# Altium schematic sheet Power.SchDoc
size Tabloid; Author: AG; SheetNumber: 3; SheetTotal: 9; PageSetup: Record=PageOptions|CenterHorizontal=True|CenterVertical=True|PrintScale=1.00|XCorrection=1.00|YCorrection=1.00|PrintKind=1|BorderSize=5000000|LeftOffset=0|BottomOffset=0|Orientation=2|PaperLength=1000|PaperWidth=1000|Scale=100|PaperSource=7|PrintQuality=-4|MediaType=1|DitherType=10|PaperKind=Ledger|PrintScaleMode=1; cpr-ItemNumber: 025619; cpr-ItemName1: TURTLEBOT4 UI Board; cpr-ItemName2: Rev 2; cpr-Revision: 2; cpr-SheetNumber: 3; cpr-SheetTotal: 9; cpr-Draft: AG; cpr-DraftDate: 19/04/2022; cpr-Rigour1: X; cpr-Rigour2: X; cpr-Rigour1Date: X; cpr-Rigour2Date: X
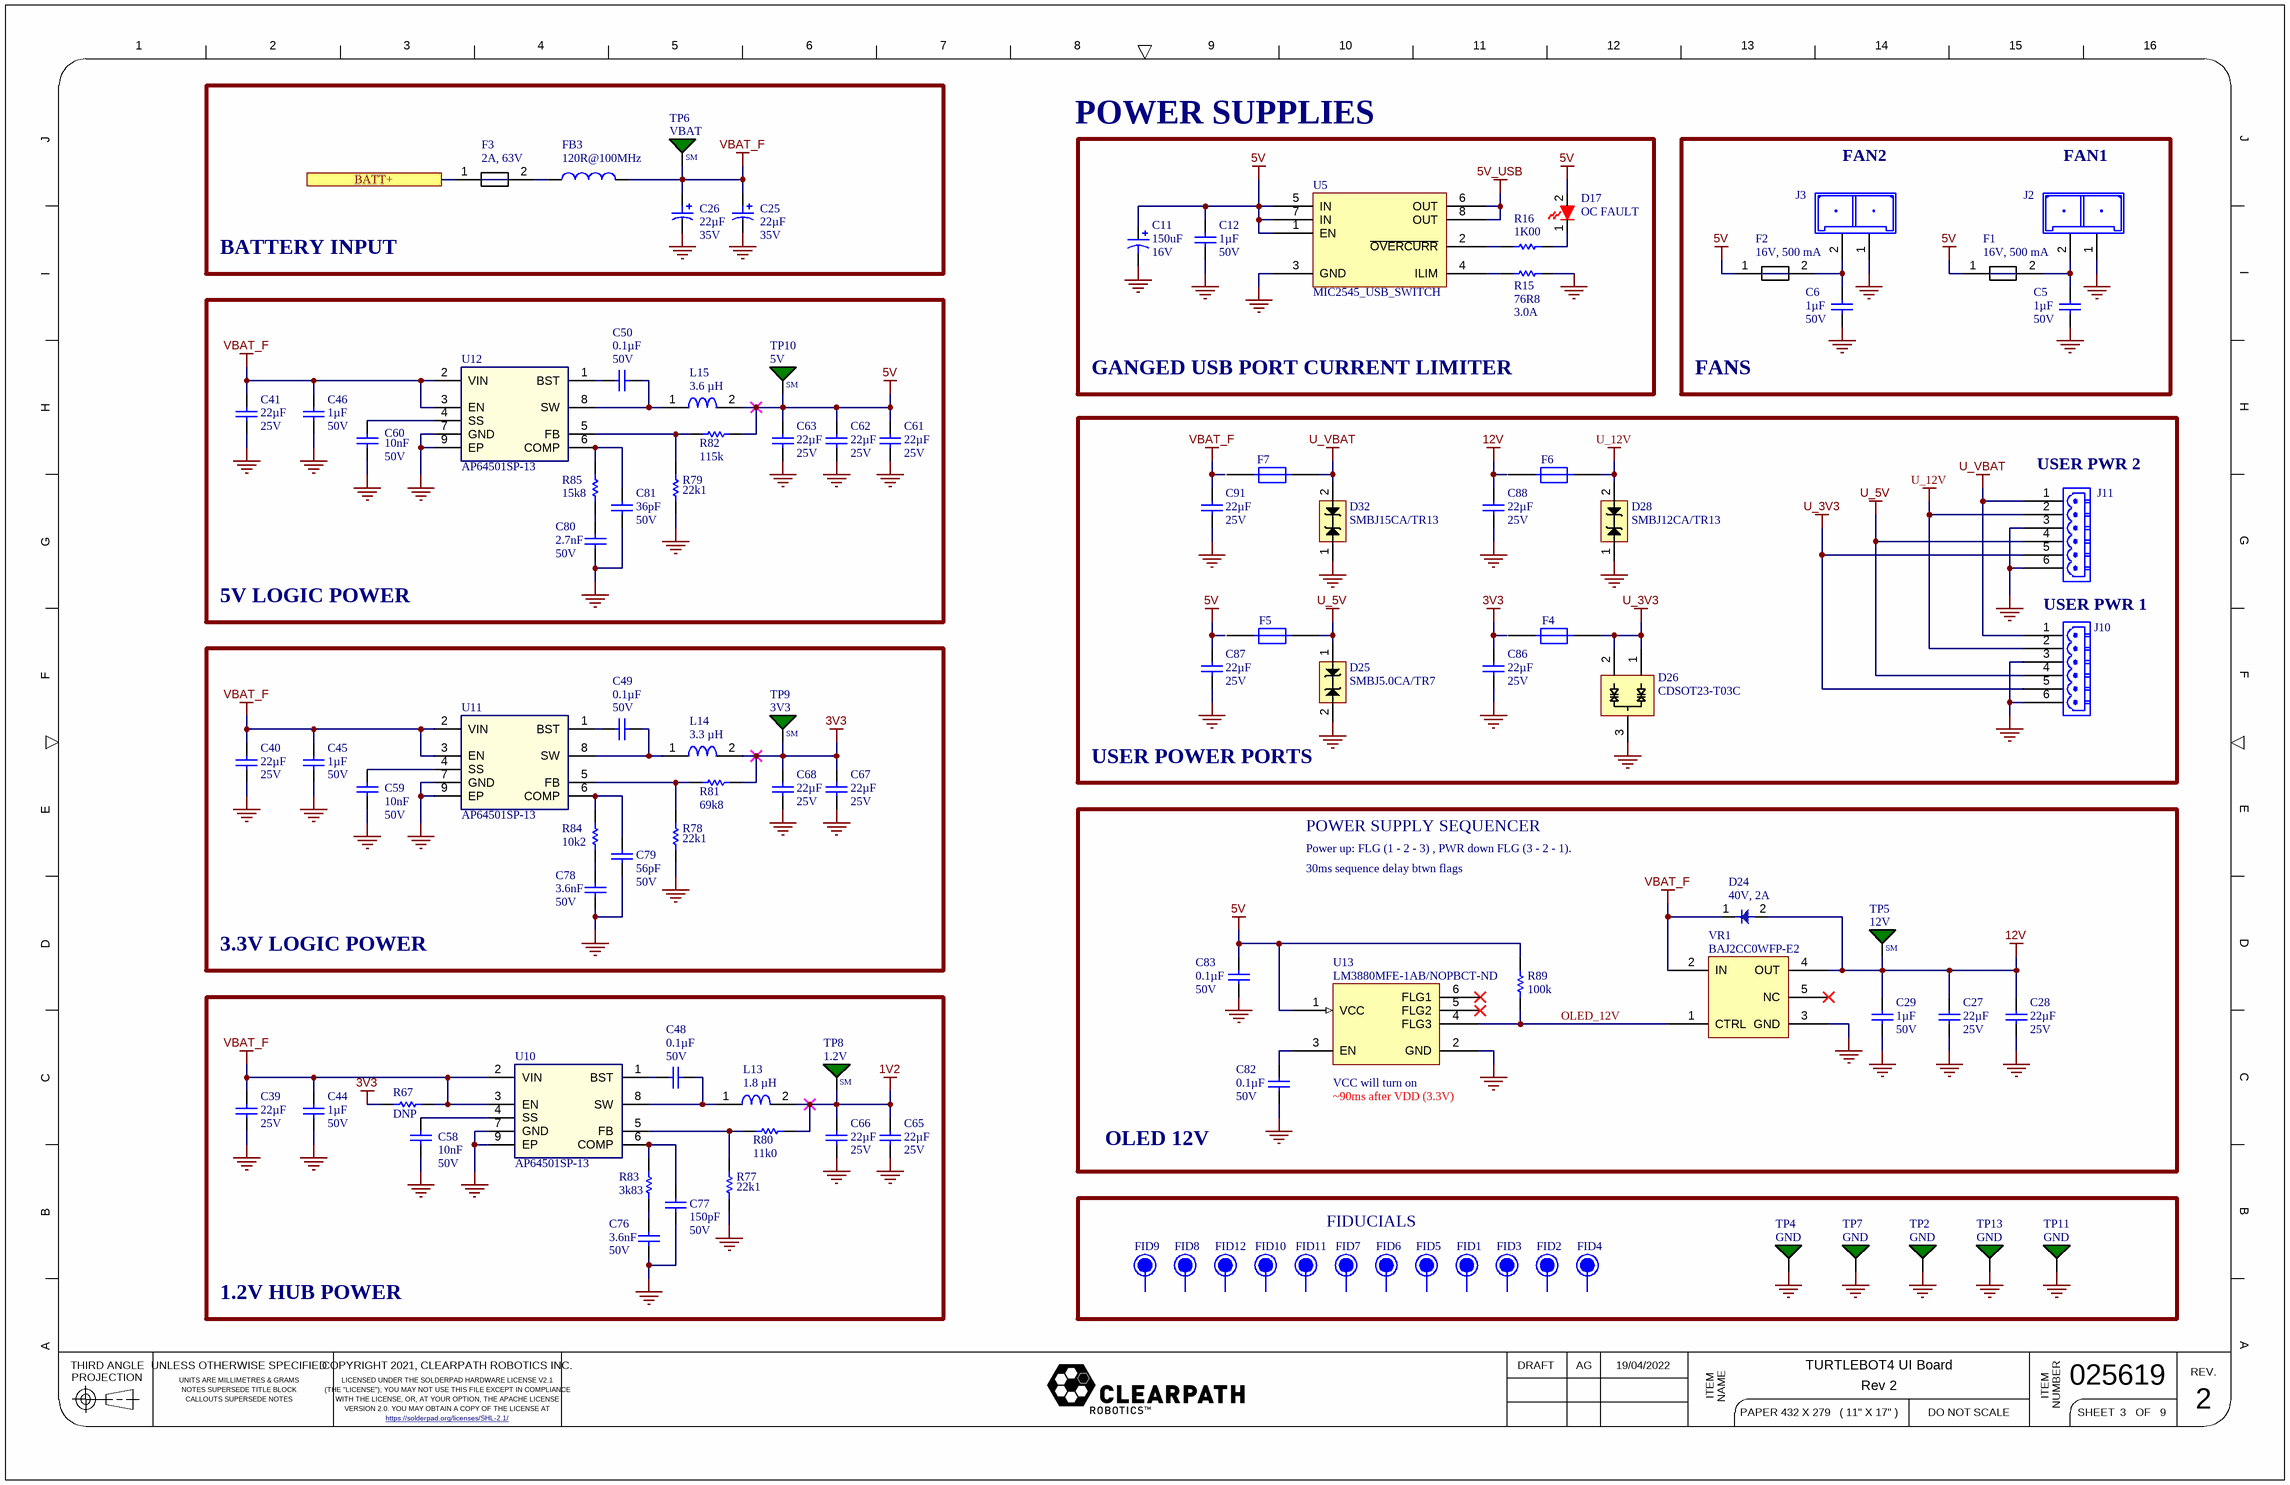
[diagram p0: Power.SchDoc]

## Parts
C5  Capacitance: 1µF  Voltage: 50V  [CAP 0805]  (hidden comment: Cap)
C6  Capacitance: 1µF  Voltage: 50V  [CAP 0805]  (hidden comment: Cap)
C11  value 150uF  Voltage: 16V  [CAPMP7.6X4.3_3.1N_KEM-M]  (hidden comment: Cap Tant)
C12  Capacitance: 1µF  Voltage: 50V  [CAP 0805]  (hidden comment: Cap)
C25  Capacitance: 22µF  Voltage: 35V  [PCAP F61]  (hidden comment: Pcap)
C26  Capacitance: 22µF  Voltage: 35V  [PCAP F61]  (hidden comment: Pcap)
C27  Capacitance: 22µF  Voltage: 25V  [CAP 1210]  (hidden comment: Cap)
C28  Capacitance: 22µF  Voltage: 25V  [CAP 1210]  (hidden comment: Cap)
C29  Capacitance: 1µF  Voltage: 50V  [CAP 0805]  (hidden comment: Cap)
C39  Capacitance: 22µF  Voltage: 25V  [CAP 1210]  (hidden comment: Cap)
C40  Capacitance: 22µF  Voltage: 25V  [CAP 1210]  (hidden comment: Cap)
C41  Capacitance: 22µF  Voltage: 25V  [CAP 1210]  (hidden comment: Cap)
C44  Capacitance: 1µF  Voltage: 50V  [CAP 0805]  (hidden comment: Cap)
C45  Capacitance: 1µF  Voltage: 50V  [CAP 0805]  (hidden comment: Cap)
C46  Capacitance: 1µF  Voltage: 50V  [CAP 0805]  (hidden comment: Cap)
C48  Capacitance: 0.1µF  Voltage: 50V  [CAP 0805]  (hidden comment: Cap)
C49  Capacitance: 0.1µF  Voltage: 50V  [CAP 0805]  (hidden comment: Cap)
C50  Capacitance: 0.1µF  Voltage: 50V  [CAP 0805]  (hidden comment: Cap)
C58  Capacitance: 10nF  Voltage: 50V  [CAP 0603]  (hidden comment: Cap)
C59  Capacitance: 10nF  Voltage: 50V  [CAP 0603]  (hidden comment: Cap)
C60  Capacitance: 10nF  Voltage: 50V  [CAP 0603]  (hidden comment: Cap)
C61  Capacitance: 22µF  Voltage: 25V  [CAP 1210]  (hidden comment: Cap)
C62  Capacitance: 22µF  Voltage: 25V  [CAP 1210]  (hidden comment: Cap)
C63  Capacitance: 22µF  Voltage: 25V  [CAP 1210]  (hidden comment: Cap)
C65  Capacitance: 22µF  Voltage: 25V  [CAP 1210]  (hidden comment: Cap)
C66  Capacitance: 22µF  Voltage: 25V  [CAP 1210]  (hidden comment: Cap)
C67  Capacitance: 22µF  Voltage: 25V  [CAP 1210]  (hidden comment: Cap)
C68  Capacitance: 22µF  Voltage: 25V  [CAP 1210]  (hidden comment: Cap)
C76  Capacitance: 3.6nF  Voltage: 50V  [CAP 0603]  (hidden comment: Cap)
C77  Capacitance: 150pF  Voltage: 50V  [CAP 0603]  (hidden comment: Cap)
C78  Capacitance: 3.6nF  Voltage: 50V  [CAP 0603]  (hidden comment: Cap)
C79  Capacitance: 56pF  Voltage: 50V  [CAP 0603]  (hidden comment: Cap)
C80  Capacitance: 2.7nF  Voltage: 50V  [CAP 0603]  (hidden comment: Cap)
C81  Capacitance: 36pF  Voltage: 50V  [CAP 0603]  (hidden comment: Cap)
C82  Capacitance: 0.1µF  Voltage: 50V  [CAP 0805]  (hidden comment: Cap)
C83  Capacitance: 0.1µF  Voltage: 50V  [CAP 0805]  (hidden comment: Cap)
C86  Capacitance: 22µF  Voltage: 25V  [CAP 1210]  (hidden comment: Cap)
C87  Capacitance: 22µF  Voltage: 25V  [CAP 1210]  (hidden comment: Cap)
C88  Capacitance: 22µF  Voltage: 25V  [CAP 1210]  (hidden comment: Cap)
C91  Capacitance: 22µF  Voltage: 25V  [CAP 1210]  (hidden comment: Cap)
D17  OC FAULT  [LED_0805_RED]
D24  40V, 2A  [SMA_DO-214AC]
D25  PCB Component: SMBJ5.0CA/TR7  [DO-214AA]  (hidden comment: TVS DIODE BIDIR 5V SMB)
D26  TVS DIODE 3.3VWM 10.9VC SOT23-3  [SOT-23-3]  (value not drawn)
D28  PCB Component: SMBJ12CA/TR13  [DO-214AA]  (hidden comment: TVS DIODE BIDIR 12V SMB)
D32  PCB Component: SMBJ15CA/TR13  [DO-214AA]  (hidden comment: TVS DIODE BIDIR 15V SMB)
F1  16V, 500 mA  [FUSE 1206]
F2  16V, 500 mA  [FUSE 1206]
F3  2A, 63V  [FUSE 1206]
F4  PTC FUSE PACKAGE 1812  [FUSER_MF-MSMF014]  (value not drawn)
F5  PTC FUSE PACKAGE 1812  [FUSER_MF-MSMF014]  (value not drawn)
F6  PTC FUSE PACKAGE 1812  [FUSER_MF-MSMF014]  (value not drawn)
F7  PTC FUSE PACKAGE 1812  [FUSER_MF-MSMF014]  (value not drawn)
FB3  value 120R@100MHz  [IND_0805]  (hidden comment: Inductor)
FID1  SMT FIDUCIAL  [Fiducial-1mm]  (value not drawn)
FID2  SMT FIDUCIAL  [Fiducial-1mm]  (value not drawn)
FID3  SMT FIDUCIAL  [Fiducial-1mm]  (value not drawn)
FID4  SMT FIDUCIAL  [Fiducial-1mm]  (value not drawn)
FID5  SMT FIDUCIAL  [Fiducial-1mm]  (value not drawn)
FID6  SMT FIDUCIAL  [Fiducial-1mm]  (value not drawn)
FID7  SMT FIDUCIAL  [Fiducial-1mm]  (value not drawn)
FID8  SMT FIDUCIAL  [Fiducial-1mm]  (value not drawn)
FID9  SMT FIDUCIAL  [Fiducial-1mm]  (value not drawn)
FID10  SMT FIDUCIAL  [Fiducial-1mm]  (value not drawn)
FID11  SMT FIDUCIAL  [Fiducial-1mm]  (value not drawn)
FID12  SMT FIDUCIAL  [Fiducial-1mm]  (value not drawn)
J2  FAN  [Molex_0533980276]  (value not drawn)
J3  FAN  [Molex_0533980276]  (value not drawn)
J10  0532610671  [MOLEX_PICOBLADE_532610671]  (value not drawn)
J11  0532610671  [MOLEX_PICOBLADE_532610671]  (value not drawn)
L13  Inductance: 1.8 µH  [IND SRP7050TA]  (hidden comment: Ind)
L14  Inductance: 3.3 µH  [IND SRP7050TA]  (hidden comment: Ind)
L15  Inductance: 3.6 µH  [IND 7447797360]  (hidden comment: Ind)
R15  3.0A  value 76R8  [R0805]
R16  value 1K00  [R0805]  (hidden comment: Resistor_SMT)
R67  Resistance: DNP  [RES 0603]  (hidden comment: Res)
R77  Resistance: 22k1  [RES 0603]  (hidden comment: Res)
R78  Resistance: 22k1  [RES 0603]  (hidden comment: Res)
R79  Resistance: 22k1  [RES 0603]  (hidden comment: Res)
R80  Resistance: 11k0  [RES 0603]  (hidden comment: Res)
R81  Resistance: 69k8  [RES 0603]  (hidden comment: Res)
R82  Resistance: 115k  [RES 0603]  (hidden comment: Res)
R83  Resistance: 3k83  [RES 0603]  (hidden comment: Res)
R84  Resistance: 10k2  [RES 0603]  (hidden comment: Res)
R85  Resistance: 15k8  [RES 0603]  (hidden comment: Res)
R89  Resistance: 100k  [RES 0603]  (hidden comment: Res)
TP2  GND  [S1751-46R]
TP4  GND  [S1751-46R]
TP5  12V  [TP_28SM]
TP6  VBAT  [TP_28SM]
TP7  GND  [S1751-46R]
TP8  1.2V  [TP_28SM]
TP9  3V3  [TP_28SM]
TP10  5V  [TP_28SM]
TP11  GND  [S1751-46R]
TP13  GND  [S1751-46R]
U5  MIC2545_USB_SWITCH  [SOIC-8-150]
U10  AP64501SP-13  [SOIC-8-EP-AP64501]
U11  AP64501SP-13  [SOIC-8-EP-AP64501]
U12  AP64501SP-13  [SOIC-8-EP-AP64501]
U13  Supplier Part Number 1: LM3880MFE-1AB/NOPBCT-ND  [SOT-23-6]  (hidden comment: Power Supply Controller Power Supply Sequencer SOT-23-6)
VR1  BAJ2CC0WFP-E2  [DPAK114P990X239-6N]

## Blocks framed on the sheet
BATTERY INPUT: C25 C26 F3 FB3 TP6
GANGED USB PORT CURRENT LIMITER: C11 C12 D17 R15 R16 U5
FANS: C5 C6 F1 F2 J2 J3
5V LOGIC POWER: C41 C46 C50 C60-C63 C80 C81 L15 R79 R82 R85 TP10 U12
USER POWER PORTS: C86-C88 C91 D25 D26 D28 D32 F4-F7 J10 J11
3.3V LOGIC POWER: C40 C45 C49 C59 C67 C68 C78 C79 L14 R78 R81 R84 TP9 U11
OLED 12V: C27-C29 C82 C83 D24 R89 TP5 U13 VR1
1.2V HUB POWER: C39 C44 C48 C58 C65 C66 C76 C77 L13 R67 R77 R80 R83 TP8 U10
FIDUCIALS: FID1-FID12 TP2 TP4 TP7 TP11 TP13

## Ports
BATT+

## Nets
1V2: C65.2 C66.2 L13.2 R80.2 TP8.1
3V3: C67.2 C68.2 C86.2 L14.2 R67.2 R81.2 TP9.1
5V: C11.1 C12.2 C61.2 C62.2 C63.2 C83.1 C87.2 D17.2(RA) F1.1 F2.1 L15.2 R82.1 R89.2 TP10.1 U5.1(EN) U5.5(IN) U5.7(IN) U13.1(VCC)
5V_USB: U5.6(OUT) U5.8(OUT)
12V: C27.2 C28.2 C29.2 C88.2 D24.2 TP5.1 VR1.4(OUT)
GND: C5.1 C6.1 C11.2 C12.1 C25.2 C26.2 C27.1 C28.1 C29.1 C39.1 C40.1 C41.1 C44.1 C45.1 C46.1 C58.1 C59.1 C60.1 C61.1 C62.1 C63.1 C65.1 C66.1 C67.1 C68.1 C76.1 C77.1 C78.1 C79.1 C80.1 C81.1 C82.2 C83.2 C86.1 C87.1 C88.1 C91.1 D25.2 D26.3 D28.1 D32.1 J2.1 J3.1 J10.3 J10.6 J11.3 J11.6 R15.1 R77.1 R78.1 R79.1 TP2.1 TP4.1 TP7.1 TP11.1 TP13.1 U5.3(GND) U10.7(GND) U10.9(EP) U11.7(GND) U11.9(EP) U12.7(GND) U12.9(EP) U13.2(GND) VR1.3(GND)
U_3V3: D26.1 D26.2 F4.2 J10.5 J11.5
U_5V: D25.1 F5.2 J10.4 J11.4
U_12V: D28.2 F6.2 J10.2 J11.2
U_VBAT: D32.2 F7.2 J10.1 J11.1
VBAT_F: C25.1 C26.1 C39.2 C40.2 C41.2 C44.2 C45.2 C46.2 C91.2 D24.1 FB3.2 R67.1 TP6.1 U10.2(VIN) U10.3(EN) U11.2(VIN) U11.3(EN) U12.2(VIN) U12.3(EN) VR1.2(IN)
BATT+: F3.1 ; port BATT+
OLED_12V: R89.1 U13.4(FLG3) VR1.1(CTRL)
NetC5_2: C5.2 F1.2 J2.2
NetC6_2: C6.2 F2.2 J3.2
NetC48_1: C48.1 U10.1(BST)
NetC48_2: C48.2 L13.1 U10.8(SW)
NetC49_1: C49.1 U11.1(BST)
NetC49_2: C49.2 L14.1 U11.8(SW)
NetC50_1: C50.1 U12.1(BST)
NetC50_2: C50.2 L15.1 U12.8(SW)
NetC58_2: C58.2 U10.4(SS)
NetC59_2: C59.2 U11.4(SS)
NetC60_2: C60.2 U12.4(SS)
NetC76_2: C76.2 R83.1
NetC77_2: C77.2 R83.2 U10.6(COMP)
NetC78_2: C78.2 R84.1
NetC79_2: C79.2 R84.2 U11.6(COMP)
NetC80_2: C80.2 R85.1
NetC81_2: C81.2 R85.2 U12.6(COMP)
NetC82_1: C82.1 U13.3(EN)
NetD17_1: D17.1(RK) R16.1
NetF3_2: F3.2 FB3.1
NetR15_2: R15.2 U5.4(ILIM)
NetR16_2: R16.2 U5.2(~{OVERCURR})
NetR77_2: R77.2 R80.1 U10.5(FB)
NetR78_2: R78.2 R81.1 U11.5(FB)
NetR79_2: R79.2 R82.2 U12.5(FB)

Not connected (* = marked no-connect by the designer): F4 1; F5 1; F6 1; F7 1; FID1 0; FID2 0; FID3 0; FID4 0; FID5 0; FID6 0; FID7 0; FID8 0; FID9 0; FID10 0; FID11 0; FID12 0; U13 5(FLG2)* 6(FLG1)*; VR1 5(NC)*

## Notes on the sheet
- POWER SUPPLIES
- FAN2
- FAN1
- (near J11) USER PWR 2
- USER PWR 1
- POWER SUPPLY SEQUENCER
- Power up: FLG (1 - 2 - 3) , PWR down FLG (3 - 2 - 1).
- 30ms sequence delay btwn flags
- (near U13) VCC will turn on
- ~90ms after VDD (3.3V)
- 1
- 2
- 3
- 4
- 5
- 6
- 7
- 8
- 9
- 10
- 11
- 12
- 13
- 14
- 15
- 16
- J
- I
- H
- G
- F
- E
- D
- C
- B
- A
- THIRD ANGLE
- PROJECTION
- UNLESS OTHERWISE SPECIFIED
- COPYRIGHT 2021, CLEARPATH ROBOTICS INC.
- DRAFT
- REV.
- UNITS ARE MILLIMETRES & GRAMS
- NOTES SUPERSEDE TITLE BLOCK
- CALLOUTS SUPERSEDE NOTES
- LICENSED UNDER THE SOLDERPAD HARDWARE LICENSE V2.1
- (THE "LICENSE"); YOU MAY NOT USE THIS FILE EXCEPT IN COMPLIANCE
- WITH THE LICENSE, OR, AT YOUR OPTION, THE APACHE LICENSE
- VERSION 2.0. YOU MAY OBTAIN A COPY OF THE LICENSE AT
- https://solderpad.org/licenses/SHL-2.1/ <https://solderpad.https://solderpad.org/licenses/SHL-2.1/org/licenses/SHL-2.1/>
- ITEM
- NAME
- PAPER 432 X 279   ( 11" X 17" )
- DO NOT SCALE
- NUMBER
- SHEET
- OF
- (in symbol TP_28SM) SM

## Library data of the parts
C5 C6 C12 C29 C44-C46 = CL21B105KBFNFNE: Capacitor, MLCC, 1 µF, 50V, X7R; Manufacturer: Samsung Electro-Mechanics America, Inc.; ID: 3; Vendor: Digi-Key; Vendor PN: 1276-2928-1-ND; PCB Component: CL21B105KBFNFNE; Status: Draft; Temperature Coefficient: X7R; Octopart Link: https://octopart.com/search?q=CL21B105KBFNFNE&start=0
C11 = Cap Pol1: CAP TANT 150UF 10% 16V 2917; Vendor: Digikey; PCB Component: 293D157X9016D2TE3; Vendor PN: 718-1746-1-ND; Mfg: Vishay Sprague; Tolerance: 10%; Package: 2917; Supplier 1: Digi-Key; Supplier Part Number 1: 718-1746-1-ND
C25 C26 = 35SVPF22M: Capacitor, Aluminum electrolytic, 22 µF, 35V; Manufacturer: Panasonic Electronic Components; ID: 51; Vendor: Digi-Key; Vendor PN: P16560CT-ND; Temperature Coefficient: -55 - 105C; PCB Component: 35SVPF22M; Status: Draft; Octopart Link: https://octopart.com/35svpf22m-panasonic-29498451?r=sp
C27 C28 C39-C41 C61-C63 C65-C68 C86-C88 C91 = CL32A226KAJNNNE: Capacitor, MLCC, 22 µF, 25V, X5R; Manufacturer: Samsung Electro-Mechanics America, Inc.; Part Number (Alternate): 12103D226MAT2A; Manufacturer (Alternate): Kyocera AVX; ID: 61; Vendor: Digi-Key; Vendor PN: 1276-1101-1-ND; PCB Component: CL32A226KAJNNNE; Status: Draft; Temperature Coefficient: X5R; RoHS: RoHS3
C48-C50 C82 C83 = 08055C104JAT4A: Capacitor, MLCC, 0.1 µF, 50V, X7R; Manufacturer: Kyocera AVX; ID: 4; Vendor: Digi-Key; Vendor PN: 478-7609-1-ND; PCB Component: 08055C104JAT4A; Status: Draft; Temperature Coefficient: X7R; Octopart Link: https://octopart.com/search?q=GRM21BR71H104JA01L&start=0
C58-C60 = 06035C103JAT2A: Capacitor, MLCC, 10 nF, 50V, X7R; Manufacturer: Kyocera AVX; ID: 6; Vendor: Digi-Key; Vendor PN: 478-5007-1-ND; PCB Component: 06035C103JAT2A; Status: Draft; Temperature Coefficient: X7R; Octopart Link: https://octopart.com/06035c103jat2a-avx-34473?r=sp&s=1d6k5wbTSZm7nYOG1M22IA
C76 C78 = GRM1885C1H362JA01D: Capacitor, MLCC, 3.6 nF, 50V, NP0/C0G; Manufacturer: Murata Electronics North America; ID: 56; Vendor: Digi-Key; Vendor PN: 490-6386-1-ND; PCB Component: GRM1885C1H362JA01D; Status: Draft; Temperature Coefficient: NP0/C0G
C77 = CC0603JRNPO9BN151: Capacitor, MLCC, 150 pF, 50V, NP0/C0G; Manufacturer: Yageo; ID: 59; Vendor: Digi-Key; Vendor PN: 311-1071-1-ND; PCB Component: CC0603JRNPO9BN151; Status: Draft; Temperature Coefficient: NP0/C0G
C79 = CC0603FRNPO9BN560: Capacitor, MLCC, 56 pF, 50V, NP0/C0G; Manufacturer: Yageo; ID: 58; Vendor: Digi-Key; Vendor PN: 311-3902-1-ND; PCB Component: CC0603FRNPO9BN560; Status: Draft; Temperature Coefficient: NP0/C0G
C80 = GRM1885C1H272JA01D: Capacitor, MLCC, 2.7 nF, 50V, NP0/C0G; Manufacturer: Murata Electronics North America; ID: 55; Vendor: Digi-Key; Vendor PN: 490-3283-1-ND; PCB Component: GRM1885C1H272JA01D; Status: Draft; Temperature Coefficient: NP0/C0G
C81 = CC0603JRNPO9BN360: Capacitor, MLCC, 36 pF, 50V, NP0/C0G; Manufacturer: Yageo; ID: 57; Vendor: Digi-Key; Vendor PN: 311-3629-1-ND; PCB Component: CC0603JRNPO9BN360; Status: Draft; Temperature Coefficient: NP0/C0G
D17 = RED_LED: Red LED; Vendor: Digikey; Mfg PN: LTST-C170EKT; Mfg: LiteOn; Vendor 1: 160-1178-1-ND; Package: 0805
D24 = CDBA240LL-HF: Diode, Schottky, 40V, 2A; Manufacturer: Comchip Technology; ID: 17; Vendor: Digi-Key; Vendor PN: 641-1698-1-ND; PCB Component: CDBA240LL-HF; Status: Draft; Type: Schottky; Current: 2A; Voltage: 40V; Octopart Link: https://octopart.com/cdba240ll-hf-comchip-22883451?r=sp&s=WlHitoGjQImeZn6B8IAMTQ
D25 = TVS DIODE BIDIR 15V SMC: TVS DIODE 5VWM 9.2VC DO214AA; pin to pad: 1>2 2>1; Vendor: Digikey; Vendor PN: YAG6582CT-ND; Mfg: YAGEO; Package: DO-214AA; Supplier 1: Digi-Key; Supplier Part Number 1: YAG6582TR-ND
D26 = CDSOT23-T03C: Supplier 1: Digi-Key; Supplier Part Number 1: CDSOT23-T03CCT-ND; PCB Component: CDSOT23-T03C
D28 = TVS DIODE BIDIR 15V SMC: TVS 600W 12.8V BI-DIR DO-214AA; Vendor: Digikey; Vendor PN: 13-SMBJ12CA/TR13CT-ND; Mfg: Littelfuse Inc.; Package: DO214AA; Supplier 1: Digi-Key; Supplier Part Number 1: F10828CT-ND
D32 = TVS DIODE BIDIR 15V SMC: TVS DIODE 15VWM 24.4VC DO214AA; Vendor: Digikey; Vendor PN: 13-SMBJ15CA/TR13CT-ND; Mfg: Littelfuse Inc.; Package: DO214AA
F1 F2 = 0ZCH0050FF2G: Fuse, PTC resettable, 500mA, 16V; Manufacturer: Bel Fuse Inc.; ID: 64; Vendor: Digi-Key; Vendor PN: 507-1786-1-ND; Type: PTC RESETTBLE FUSE; PCB Component: 0ZCH0050FF2G; Status: Draft; Current: 500mA; Voltage: 16V; Octopart Link: https://octopart.com/0zcg0050af2c-bel+fuse-29404475?r=sp&s=MeWAm1DXRLGSSGG39g68fg
F3 = 0685T2000-01: Fuse, Slow blow, 2A, 63V; Manufacturer: Bel Fuse Inc.; ID: 36; Vendor: Digi-Key; Vendor PN: 507-1894-1-ND; Type: Slow Blow Fuse; PCB Component: 0685T2000-01; Status: Draft; Current: 2A; Voltage: 63V; Octopart Link: https://octopart.com/search?q=C1S+2
F4-F7 = PTC_1812: Supplier 1: Digi-Key
  F4: Parameter 1: *; Supplier Part Number 1: 507-1758-1-ND
  F5: Supplier Part Number 1: 507-1762-1-ND
  F6 F7: Supplier Part Number 1: 507-1760-1-ND
FB3 = Inductor: Mfg PN: BLM21PG121SH1D; Vendor: Digikey; Vendor PN: 490-12626-1-ND; Mfg: Murata; Package: 0805
FID1-FID12 = FIDUCIAL
J2 J3 = Molex_533750210: Manufacturer: Molex; Vendor PN: WM3421-ND; Vendor: Digikey
J10 J11 = Component_1: Supplier 1: Digi-Key; Supplier Part Number 1: WM7624CT-ND
L13 = SRP7050TA-1R8M: Inductor, 1.8 µH, 12.0A, Wirewound, Shielded; Manufacturer: Bourns Inc; ID: 14; Vendor: Digi-Key; Vendor PN: SRP7050TA-1R8MCT-ND; Resistance: 11 mOhm; Current - Sat: 15 A; Tolerance: ± 20%; PCB Component: SRP7050TA-1R8M; Status: Draft
L14 = SRP7050TA-3R3M: Inductor, 3.3 µH, 8.0A, Wirewound, Shielded; Manufacturer: Bourns Inc; ID: 13; Vendor: Digi-Key; Vendor PN: SRP7050TA-3R3MCT-ND; Resistance: 20.9 mOhm; Current - Sat: 12 A; Tolerance: ± 20%; PCB Component: SRP7050TA-3R3M; Status: Draft
L15 = 7447797360: Inductor, 3.6 µH, 8.2A, Wirewound, Shielded; Manufacturer: Würth Elektronik; ID: 12; Vendor: Digi-Key; Vendor PN: 732-2210-1-ND; Resistance: 12.2 mOhm; Current - Sat: 8.5 A; Tolerance: ± 20%; PCB Component: 7447797360; Status: Draft
R15 = Resistor_SMT: Resistor; Vendor: Digikey; Vendor PN: 311-76.8CRCT-ND; Tolerance: 1%; Mfg: Yageo; Mfg PN: RC0805FR-0776R8L; Power Rating: *; Package: 0805
R16 = Resistor_SMT: Resistor; Vendor: Digikey; Vendor PN: 311-1.00KCRCT-ND; Tolerance: 1%; Mfg: Yageo; Mfg PN: RC0805FR-071KL; Power Rating: *; Package: 0805
R67 R83 = RC0603FR-073K83L: Resistor, Film, 3.83 kOhm, ±1%, 0603; Manufacturer: Yageo; ID: 37; Vendor: Digi-Key; Vendor PN: 311-3.83KHRCT-ND; Power: 1/10W; PCB Component: RC0603FR-073K83L; Tolerance: ±1%; Status: Draft; Octopart Link: https://octopart.com/search?q=RC0603FR-073K83L&start=0
R77-R79 = RC0603FR-0722K1L: Resistor, Film, 22.1 kOhm, ±1%, 0603; Manufacturer: Yageo; ID: 129; Vendor: Digi-Key; Vendor PN: 311-22.1KHRCT-ND; Power: 1/10W; PCB Component: RC0603FR-0722K1L; Tolerance: ±1%; Status: Draft
R80 = RC0603FR-0711KL: Resistor, Film, 11.0  kOhm, ±1%, 0603; Manufacturer: Yageo; ID: 131; Vendor: Digi-Key; Vendor PN: 311-11.0KHRCT-ND; Power: 1/10W; PCB Component: RC0603FR-0711KL; Tolerance: ±1%; Status: Draft
R81 = RC0603FR-0769K8L: Resistor, Film, 69.8  kOhm, ±1%, 0603; Manufacturer: Yageo; ID: 132; Vendor: Digi-Key; Vendor PN: 311-69.8KHRCT-ND; Power: 1/10W; PCB Component: RC0603FR-0769K8L; Tolerance: ±1%; Status: Draft
R82 = RC0603FR-07115KL: Resistor, Film, 115 kOhm, ±1%, 0603; Manufacturer: Yageo; ID: 128; Vendor: Digi-Key; Vendor PN: 311-115KHRCT-ND; Power: 1/10W; PCB Component: RC0603FR-07115KL; Tolerance: ±1%; Status: Draft
R84 = RC0603FR-0710K2L: Resistor, Film, 10k2  kOhm, ±1%, 0603; Manufacturer: Yageo; ID: 134; Vendor: Digi-Key; Vendor PN: 311-10.2KHRCT-ND; Power: 1/10W; PCB Component: RC0603FR-0710K2L; Tolerance: ±1%; Status: Draft
R85 = RC0603FR-0715K8L: Resistor, Film, 15.8 kOhm, ±1%, 0603; Manufacturer: Yageo; ID: 130; Vendor: Digi-Key; Vendor PN: 311-15.8KHRCT-ND; Power: 1/10W; PCB Component: RC0603FR-0715K8L; Tolerance: ±1%; Status: Draft
R89 = RC0603FR-07100KL: Resistor, Film, 100 kOhm, ±1%, 0603; Manufacturer: Yageo; ID: 14; Vendor: Digi-Key; Vendor PN: 311-100KHRCT-ND; Power: 1/10W; PCB Component: RC0603FR-07100KL; Tolerance: ±1%; Status: Draft; Octopart Link: https://octopart.com/search?q=RC0603FR-07100KL&start=0
TP2 TP7 TP11 TP13 = S1751-46R: Test point, Surface mount loop; Manufacturer: Harwin Inc.; ID: 3; Vendor: Digi-Key; Vendor PN: 952-1478-1-ND; PCB Component: S1751-46R; Status: Draft; Type: SMD; Features: SMD Loop; Octopart Link: https://octopart.com/search?q=S1751-46R&start=0
TP4 = S1751-46R: Surface mount test point; Manufacturer: Harwin Inc.; ID: 3; Vendor: Digi-Key; Vendor PN: 952-1478-1-ND; PCB Component: S1751-46R; Type: SMD; Features: SMD Loop; Octopart Link: https://octopart.com/search?q=S1751-46R&start=0
TP5 TP6 TP8-TP10 = TP_28SM: Test point, 28 Mil exposed pad; Manufacturer: Clearpath Robotics Inc.; ID: 1; PCB Component: TP_28SM; Status: Draft; Vendor: Clearpath Robotics Inc.; Vendor PN: TP_28SM; Type: SM Pad; Features: Exposed 28mil pad; Octopart Link: N/A
U5 = MIC2545_USB_SWITCH: IC PWR SWITCH N-CHAN 1:1 8SOIC; Vendor PN: MIC2545A-1YM-CT-ND; Vendor: Digikey; Mfg PN: MIC2545A-1YM-TR; Mfg: Microchip; Package: SOIC8
U10-U12 = AP64501SP-13: DC/DC Converter, Buck, 3.8-40V, 5A; Manufacturer: Diodes Incorporated; ID: 41; Vendor: Digi-Key; Vendor PN: 31-AP64501SP-13CT-ND; Output Voltage: Adj; PCB Component: AP64501SP-13; Status: Draft; Type: DC/DC converter, Buck; Current: 5A; Input Voltage Range: 3.8 - 40V; RoHS: RoHS3
U13 = LM3880MFE-1AB/NOPB: Power up :1 - 2 - 3 , PWR down 3 - 2 - 1. 120ms sequence delay; Supplier 1: Digi-Key